# Altium project Lacrosse_Ball.PrjPcb
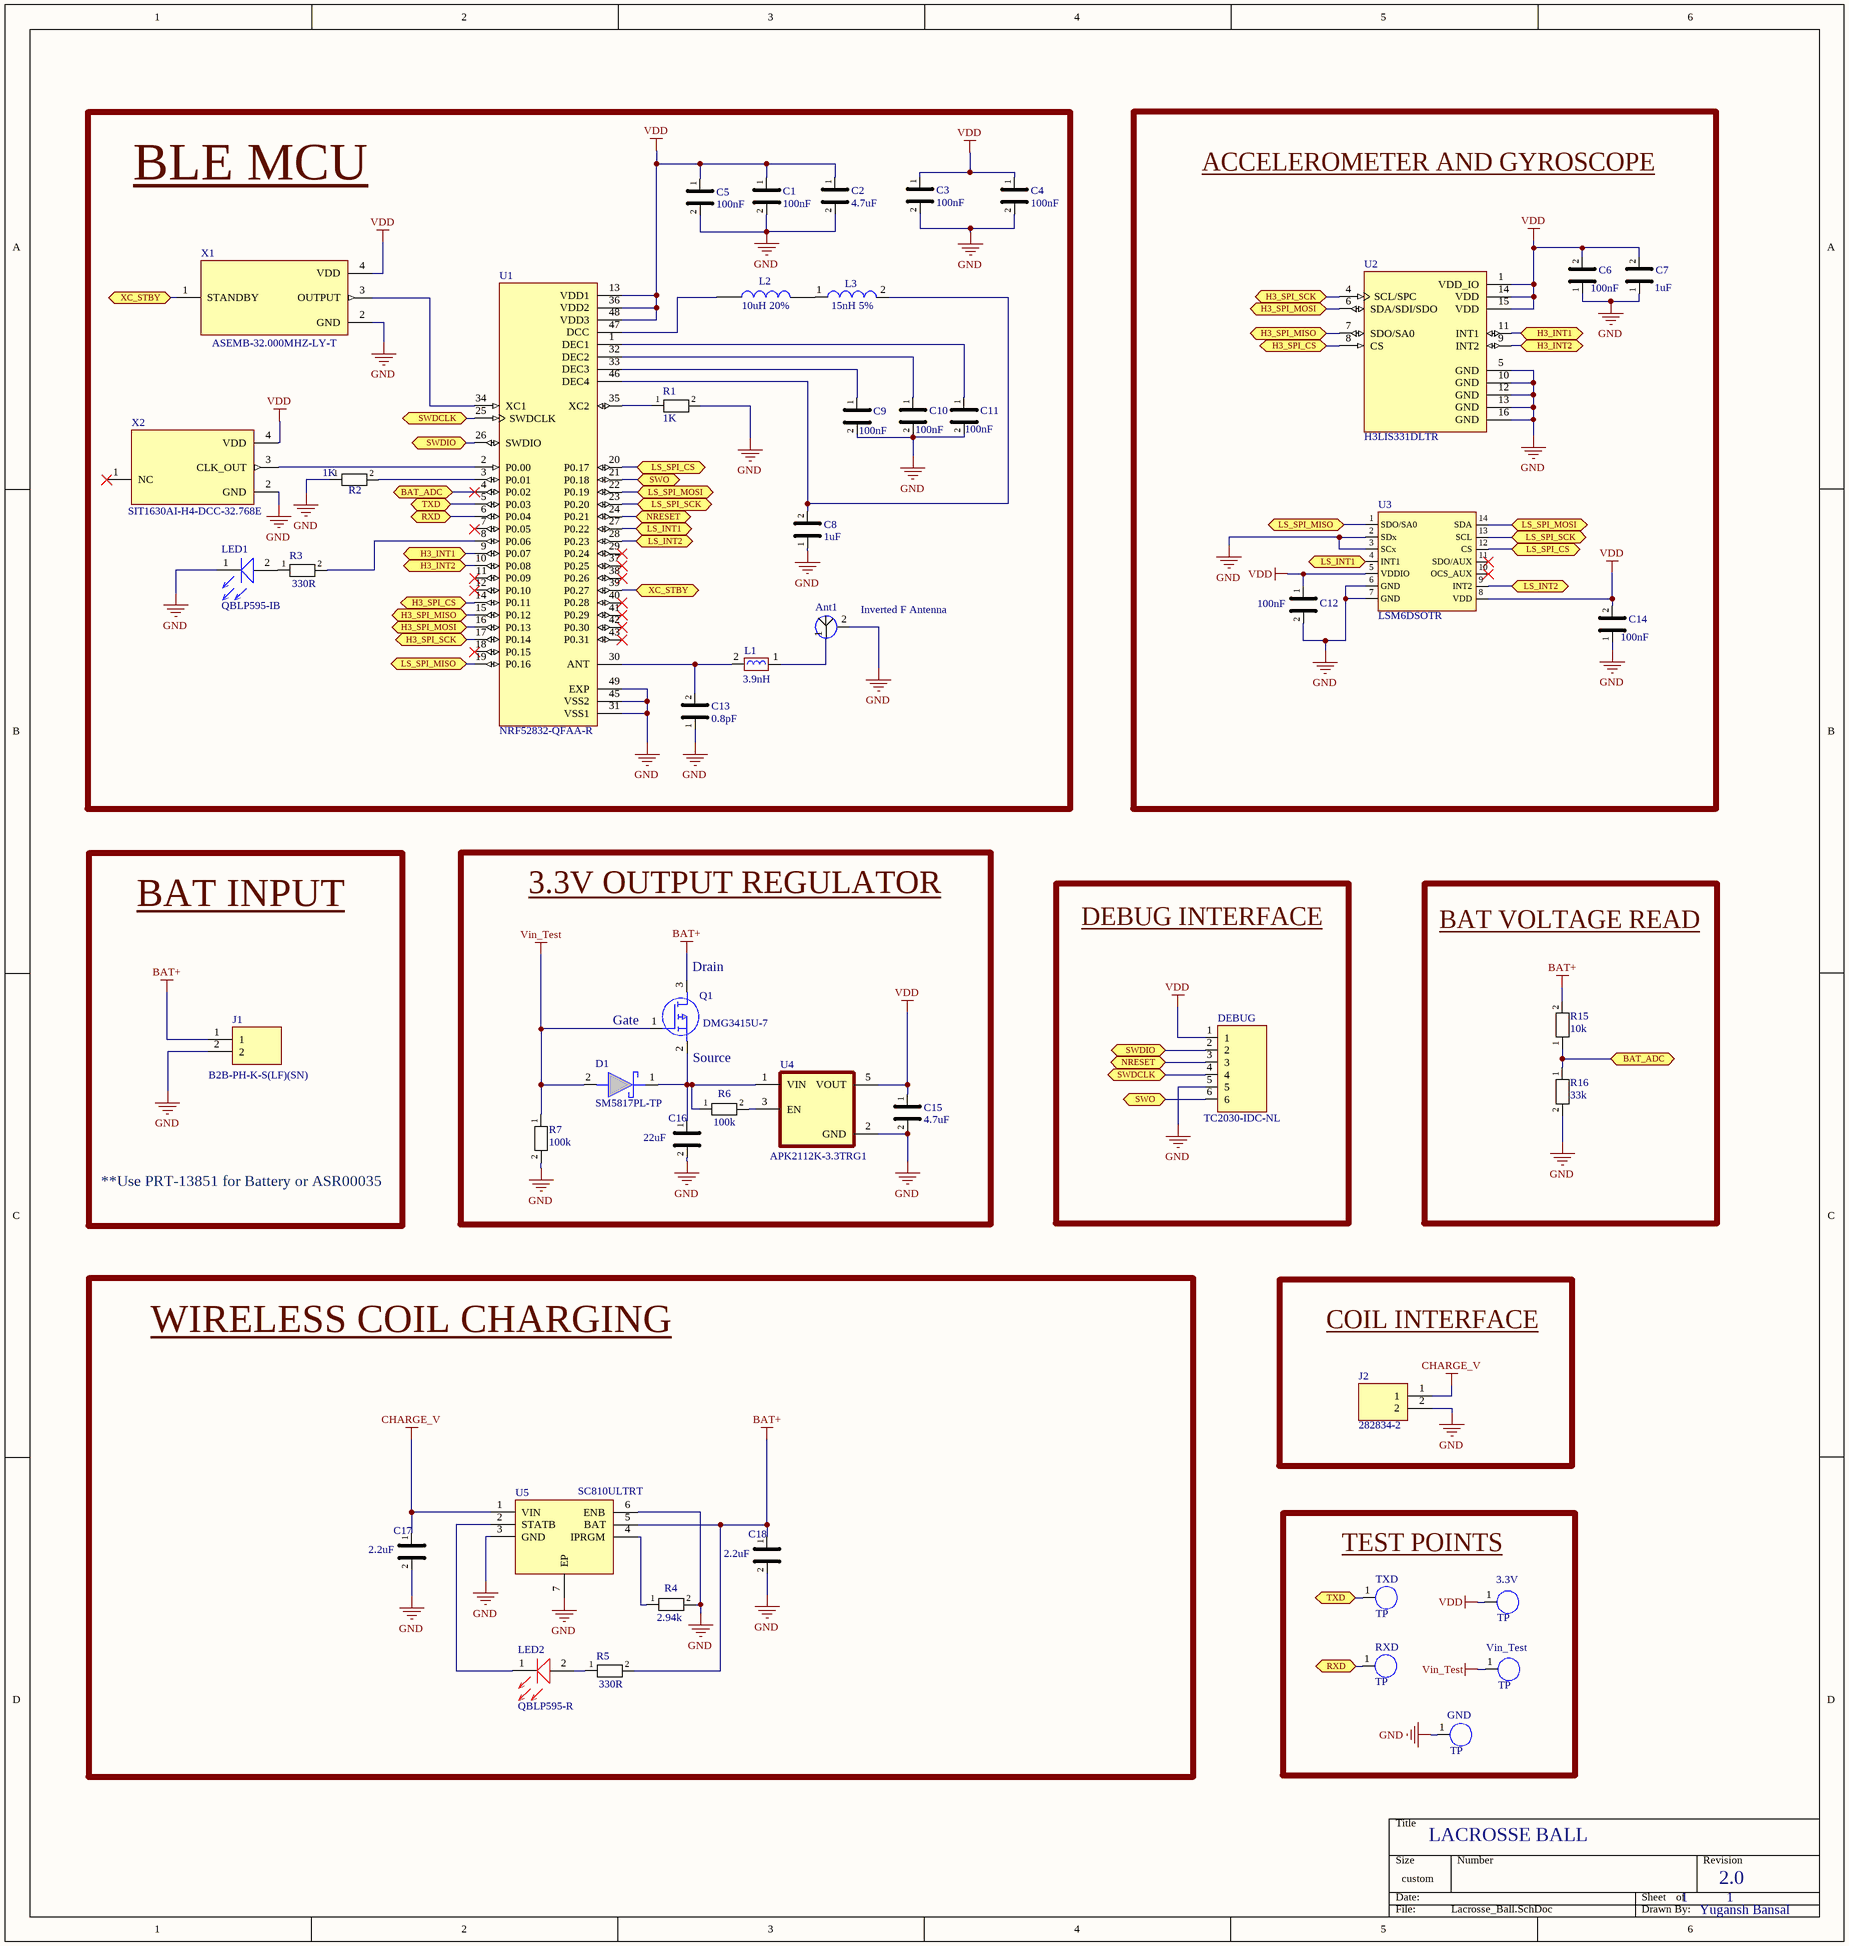
[diagram p0: Lacrosse_Ball.SchDoc]
1 sheet, 50 parts. Net scope: flat (ports and power ports of the same name join across sheets).
Board file: Lacrosse_Ball.PcbDoc

## Sheet Lacrosse_Ball.SchDoc
size 379 x 400 mm

### Parts
3.3V  TP  [TP]
Ant1  Inverted F Antenna  [Inverted_F_Antenna]  (net tie)
C1  100nF  [C0201]
C2  4.7uF  [C0402]
C3  100nF  [C0201]
C4  100nF  [C0201]
C5  100nF  [C0201]
C6  100nF  [C0201]
C7  1uF  [C0402]
C8  1uF  [C0402]
C9  100nF  [C0201]
C10  100nF  [C0201]
C11  100nF  [C0201]
C12  100nF  [C0201]
C13  0.8pF  [C0201]
C14  100nF  [C0201]
C15  4.7uF  [C0402]
C16  22uF  [C0603]
C17  2.2uF  [C0603]
C18  2.2uF  [C0603]
D1  SM5817PL-TP  [SM5817PL-TP]
DEBUG  TC2030-IDC-NL  [TC2030-IDC-NL]
GND  TP  [TP]
J1  B2B-PH-K-S(LF)(SN)  [B2B-PH-K-S(LF)(SN)]
J2  282834-2  [282834-2]
L1  3.9nH  [C0201]
L2  10uH 20%  [LQM18DN100M70L]
L3  15nH 5%  [LQG15HZ15NJ02D]
LED1  QBLP595-IB  [QBLP595-IB]
LED2  QBLP595-R  [QBLP595-R]
Q1  DMG3415U-7  [DMG3415U-7]
R1  1K  [R0201]
R2  1K  [R0201]
R3  330R  [R0201]
R4  2.94k  [R0201]
R5  330R  [R0201]
R6  100k  [R0201]
R7  100k  [R0201]
R15  10k  [R0201]
R16  33k  [R0201]
RXD  TP  [TP]
TXD  TP  [TP]
U1  NRF52832-QFAA-R  [VFQFN-48]
U2  H3LIS331DLTR  [TFLGA-16(3x3)]
U3  LSM6DSOTR  [LGA-14(2.5x3)]
U4  APK2112K-3.3TRG1  [SOT-25-5]
U5  SC810ULTRT  [SC810ULTRT]
Vin_Test  TP  [TP]
X1  ASEMB-32.000MHZ-LY-T  [ASEMB-32.000MHZ-LY-T]
X2  SIT1630AI-H4-DCC-32.768E  [SIT1630AI-H4-DCC-32.768E]

### Blocks framed on the sheet
BLE MCU: Ant1 C1-C5 C8-C11 C13 L1-L3 LED1 R1-R3 U1 X1 X2
ACCELEROMETER AND GYROSCOPE: C6 C7 C12 C14 U2 U3
BAT INPUT: J1
3.3V OUTPUT REGULATOR: C15 C16 D1 Q1 R6 R7 U4
DEBUG INTERFACE: DEBUG
BAT VOLTAGE READ: R15 R16
WIRELESS COIL CHARGING: C17 C18 LED2 R4 R5 U5
COIL INTERFACE: J2
TEST POINTS: 3.3V GND RXD TXD Vin_Test

### Ports
BAT_ADC (bidir), H3_INT1 (bidir), H3_INT2 (bidir), H3_SPI_CS (bidir), H3_SPI_MISO (bidir), H3_SPI_MOSI (bidir), H3_SPI_SCK (bidir), LS_INT1 (bidir), LS_INT2 (bidir), LS_SPI_CS (bidir), LS_SPI_MISO (bidir), LS_SPI_MOSI (bidir), LS_SPI_SCK (bidir), NRESET (bidir), RXD (bidir), SWDCLK (bidir), SWDIO (bidir), SWO (bidir), TXD (bidir), XC_STBY (bidir)

### Nets
BAT+: C18.1 J1.1 Q1.3(D) R5.2 R15.2 U5.5(BAT)
CHARGE_V: C17.1 J2.1 U5.1(VIN)
GND: Ant1.2 C1.2 C2.2 C3.2 C4.2 C5.2 C6.1 C7.1 C8.1 C9.2 C10.2 C11.2 C12.2 C13.1 C14.1 C15.2 C16.2 C17.2 C18.2 DEBUG.5 GND.1 J1.2 J2.2 LED1.1(CATHODE_(-)) R1.2 R2.1 R4.2 R7.2 R16.2 U1.31(VSS1) U1.45(VSS2) U1.49(EXP) U2.5(GND) U2.10(GND) U2.12(GND) U2.13(GND) U2.16(GND) U3.2(SDx) U3.3(SCx) U3.6(GND) U3.7(GND) U4.2(GND) U5.3(GND) U5.6(ENB) U5.7(EP) X1.2(GND) X2.2(GND)
VDD: 3.3V.1 C1.1 C2.1 C3.1 C4.1 C5.1 C6.2 C7.2 C12.1 C14.2 C15.1 DEBUG.1 U1.13(VDD1) U1.36(VDD2) U1.48(VDD3) U2.1(VDD_IO) U2.14(VDD) U2.15(VDD) U3.5(VDDIO) U3.8(VDD) U4.5(VOUT) X1.4(VDD) X2.4(VDD)
Vin_Test: D1.2(A) Q1.1(G) R7.1 Vin_Test.1
NetAnt1_1: Ant1.1 L1.1
NetC8_2: C8.2 L3.2 U1.46(DEC4)
NetC9_1: C9.1 U1.33(DEC3)
NetC10_1: C10.1 U1.32(DEC2)
NetC11_1: C11.1 U1.1(DEC1)
NetC13_2: C13.2 L1.2 U1.30(ANT)
NetC16_1: C16.1 D1.1(K) Q1.2(S) R6.1 U4.1(VIN)
NetDEBUG_2: DEBUG.2 U1.26(SWDIO) ; port SWDIO
NetDEBUG_3: DEBUG.3 U1.24(P0.21) ; port NRESET
NetDEBUG_4: DEBUG.4 U1.25(SWDCLK) ; port SWDCLK
NetDEBUG_6: DEBUG.6 U1.21(P0.18) ; port SWO
NetL2_1: L2.1 U1.47(DCC)
NetL2_2: L2.2 L3.1
NetLED1_2: LED1.2(ANODE_(+)) R3.1
NetLED2_1: LED2.1(CATHODE_(-)) U5.2(STATB)
NetLED2_2: LED2.2(ANODE_(+)) R5.1
NetR1_1: R1.1 U1.35(XC2)
NetR2_2: R2.2 U1.3(P0.01)
NetR3_2: R3.2 U1.8(P0.06)
NetR4_1: R4.1 U5.4(IPRGM)
NetR6_2: R6.2 U4.3(EN)
NetR15_1: R15.1 R16.1 U1.4(P0.02) ; port BAT_ADC
NetRXD_1: RXD.1 U1.6(P0.04) ; port RXD
NetTXD_1: TXD.1 U1.5(P0.03) ; port TXD
NetU1_2: U1.2(P0.00) X2.3(CLK_OUT)
NetU1_9: U1.9(P0.07) U2.11(INT1) ; port H3_INT1
NetU1_10: U1.10(P0.08) U2.9(INT2) ; port H3_INT2
NetU1_14: U1.14(P0.11) U2.8(CS) ; port H3_SPI_CS
NetU1_15: U1.15(P0.12) U2.7(SDO/SA0) ; port H3_SPI_MISO
NetU1_16: U1.16(P0.13) U2.6(SDA/SDI/SDO) ; port H3_SPI_MOSI
NetU1_17: U1.17(P0.14) U2.4(SCL/SPC) ; port H3_SPI_SCK
NetU1_19: U1.19(P0.16) U3.1(SDO/SA0) ; port LS_SPI_MISO
NetU1_20: U1.20(P0.17) U3.12(CS) ; port LS_SPI_CS
NetU1_22: U1.22(P0.19) U3.14(SDA) ; port LS_SPI_MOSI
NetU1_23: U1.23(P0.20) U3.13(SCL) ; port LS_SPI_SCK
NetU1_27: U1.27(P0.22) U3.4(INT1) ; port LS_INT1
NetU1_28: U1.28(P0.23) U3.9(INT2) ; port LS_INT2
NetU1_34: U1.34(XC1) X1.3(OUTPUT)
NetU1_39: U1.39(P0.27) X1.1(STANDBY) ; port XC_STBY

Not connected (* = marked no-connect by the designer): U1 7(P0.05)* 11(P0.09)* 12(P0.10)* 18(P0.15)* 29(P0.24)* 37(P0.25)* 38(P0.26)* 40(P0.28)* 41(P0.29)* 42(P0.30)* 43(P0.31)*; U3 10(OCS_AUX)* 11(SDO/AUX)*; X2 1(NC)*

### Notes on the sheet
- (near Q1) Drain
- (near Q1) Gate
- (near Q1) Source
- **Use PRT-13851 for Battery or ASR00035
- LACROSSE BALL
- 1
- 2.0
- Yugansh Bansal

### Library data of the parts
Ant1 = Antenna
C1 C3-C6 C9-C12 C14 = Capacitor 100nF: MF: muRata(村田); MP: GRM033Z71A104KE14D; JLCPCBPart#: C161494; Package: C0201
C2 C15 = capacitor 4.7uF: MF: SAMSUNG(三星); MP: CL05A475MP5NRNC; JLCPCBPart#: C23733; Package: C0402
C7 C8 = Capacitor 1uF: MF: muRata(村田); MP: GRM155Z71A105KE01D; JLCPCBPart#: C528974; Packag: C0402
C13 = Capacitor 0.8pF: MF: YAGEO(国巨); MP: CC0201CRNPO9BNR80; JLCPCBPart#: C327151; package: C0201
C16-C18 = capacitor 22uF: MF: muRata(村田); MP: GRM188R61A226ME15D; JLCPCBPart#: C84419; Package: C0603
D1 = SM5817PL-TP: DIODE SCHOTTKY 20V 1A SOD123FL
DEBUG = TC2030-IDC-NL: Tag Connector 6POS
J1 = B2B-PH-K-S(LF)(SN): CONN HEADER VERT 2POS 2MM
J2 = 282834-2: TERM BLK 2P SIDE ENT 2.54MM PCB
L1 = 3.9nH  Inductor: MF: TDK; MP: MLG0603S3N9ST000; Packag: L0201; JLCPCBPart#: C136219
L2 = LQM18DN100M70L: FIXED IND 10UH 300MA
L3 = LQG15HZ15NJ02D: FIXED IND 15NH 450MA 320MOHM SMD
LED1 = QBLP595-IB: LED BLUE CLEAR 0402 SMD
LED2 = QBLP595-R: LED RED CLEAR 0402 SMD
Q1 = DMG3415U-7: MOSFET P-CH 20V 4A SOT23-3
R1 R2 = resistor 1K: MF: YAGEO(国巨); MP: RC0201JR-071KL; JLCPCBPart#: C131396; Package: R0201
R3 R5 = resistor 1K: Resistor 0201 330ohm; MF: YAGEO(国巨); MP: RC0201JR-071KL; JLCPCBPart#: C131396; Package: R0201
R4 = resistor 1K: Resistor 0201 2.94kohm; MF: YAGEO(国巨); MP: RC0201JR-071KL; JLCPCBPart#: C131396; Package: R0201
R6 R7 = 4.7K: RC0201FR-07100KL  RES 100K OHM 1% 1/20W 0201; MF: Vishay Intertech; MP: CRCW02014K70JNED; JLCPCBPart#: C2073629; Package: 0201
R15 = 4.7K: 10k 1% Chip resistor; MF: Vishay Intertech; MP: CRCW02014K70JNED; JLCPCBPart#: C2073629; Package: 0201
R16 = 4.7K: 33k 1% chip resistor; MF: Vishay Intertech; MP: CRCW02014K70JNED; JLCPCBPart#: C2073629; Package: 0201
U1 = NRF52832-QFAA-R: 2Mbps 2.4GHz Bluetooth 2.4GHz I2C,SPI,UART QFN-48-EP(6x6) RF Transceiver ICs ROHS; MF: Nordic Semicon; MP: NRF52832-QFAA-R; JLCPCBPart#: C77540; Packag: QFN-48-EP(6x6)
U2 = H3LIS331DLTR: TFLGA-16(3x3) Attitude Sensor/Gyroscope ROHS; MF: STMicroelectronics; MP: H3LIS331DLTR; JLCPCBPart#: C2655074; Package: TFLGA-16(3x3)
U3 = LSM6DSOTR: LGA-14(2.5x3) Attitude Sensor/Gyroscope ROHS; MF: STMicroelectronics; MP: LSM6DSOTR; JLCPCBPart#: C2655100; packag: LGA-14(2.5x3)
U4 = APK2112K-3.3TRG1: 65dB@(100Hz,1kHz) 600mA Fixed 3.3V~3.3V Positive 6V SOT-23-5 Linear Voltage Regulators (LDO) ROHS; MF: Diodes Incorporated; MP: AP2112K-3.3TRG1; JLCPCBPart#: C51118; Package: SOT-25-5
U5 = SC810ULTRT: IC BATT CHG LI-ION 1CELL 6MLP
X1 = ASEMB-32.000MHZ-LY-T: MEMS OSC XO 32.0000MHZ CMOS SMD
X2 = SIT1630AI-H4-DCC-32.768E: MEMS OSC XO 32.7680KHZ LVCMOS